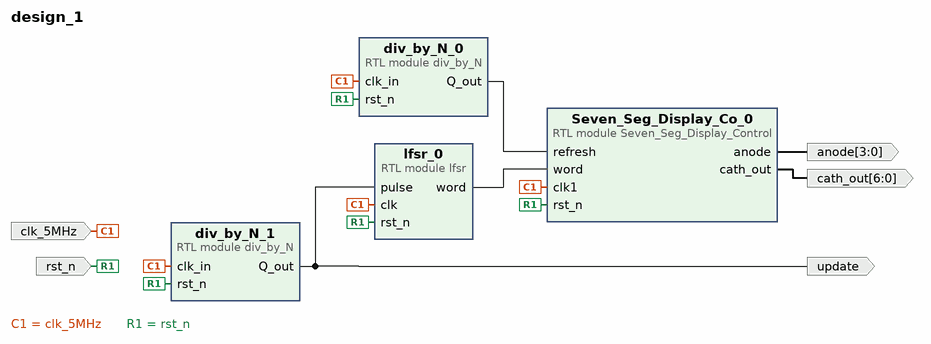
[diagram p0: block diagram of the top level]
# Vivado block design design_1, xc7a35tcpg236-1, Vivado 2022.2
create_bd_design design_1

create_bd_port -dir O -from 3 -to 0 anode
create_bd_port -dir O -from 6 -to 0 cath_out
create_bd_port -dir I -type clk clk_5MHz
set_property -dict {CONFIG.FREQ_HZ 100000000} [get_bd_ports clk_5MHz]
create_bd_port -dir I rst_n
create_bd_port -dir O update

create_bd_cell -type module -reference div_by_N div_by_N_0
create_bd_cell -type module -reference div_by_N div_by_N_1
set_property -dict {CONFIG.N 5000000 CONFIG.Nb 23} [get_bd_cells div_by_N_1]
create_bd_cell -type module -reference lfsr lfsr_0
create_bd_cell -type module -reference Seven_Seg_Display_Control Seven_Seg_Display_Co_0

# ---- connections ----

connect_bd_net [get_bd_pins Seven_Seg_Display_Co_0/anode] [get_bd_ports anode]
connect_bd_net [get_bd_pins Seven_Seg_Display_Co_0/cath_out] [get_bd_ports cath_out]
connect_bd_net -net clk_wiz_0_clk_out1 [get_bd_ports clk_5MHz] \
  [get_bd_pins div_by_N_0/clk_in] [get_bd_pins div_by_N_1/clk_in] [get_bd_pins lfsr_0/clk] \
  [get_bd_pins Seven_Seg_Display_Co_0/clk1]
connect_bd_net [get_bd_pins div_by_N_0/Q_out] [get_bd_pins Seven_Seg_Display_Co_0/refresh]
connect_bd_net [get_bd_pins div_by_N_1/Q_out] [get_bd_pins lfsr_0/pulse] [get_bd_ports update]
connect_bd_net [get_bd_pins lfsr_0/word] [get_bd_pins Seven_Seg_Display_Co_0/word]
connect_bd_net -net reset_gen_0_rst_n [get_bd_ports rst_n] \
  [get_bd_pins div_by_N_1/rst_n] [get_bd_pins lfsr_0/rst_n] [get_bd_pins div_by_N_0/rst_n] \
  [get_bd_pins Seven_Seg_Display_Co_0/rst_n]

validate_bd_design
save_bd_design
